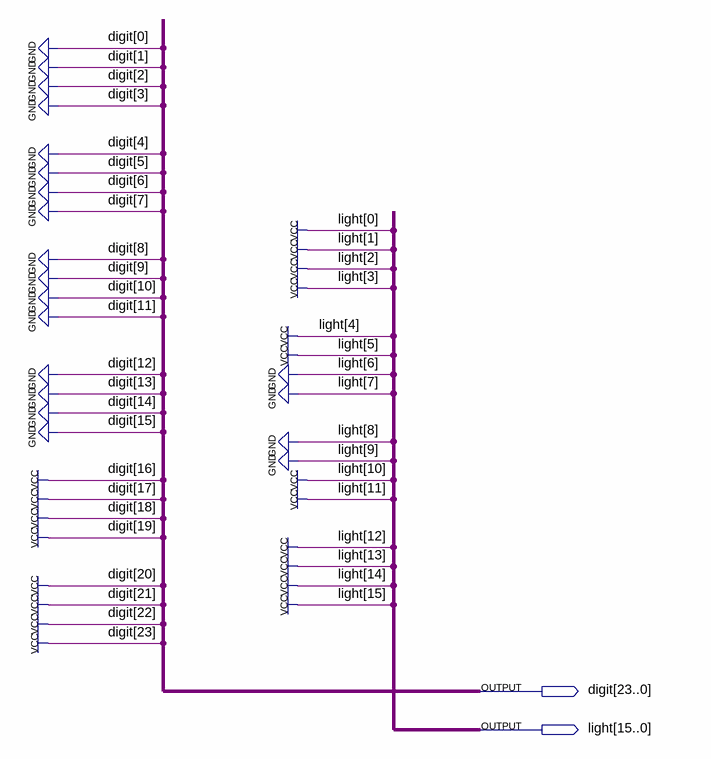
[diagram p0: schematic sheet]
// Quartus schematic Pattern_6_Frame_6.bdf as structural Verilog: 0 symbols, 2 pins
module Pattern_6_Frame_6 (
  output [23:0] digit,
  output [15:0] light
);


  assign digit = 24'b111111110000000000000000;
  assign light = 16'b1111110000111111;
endmodule
